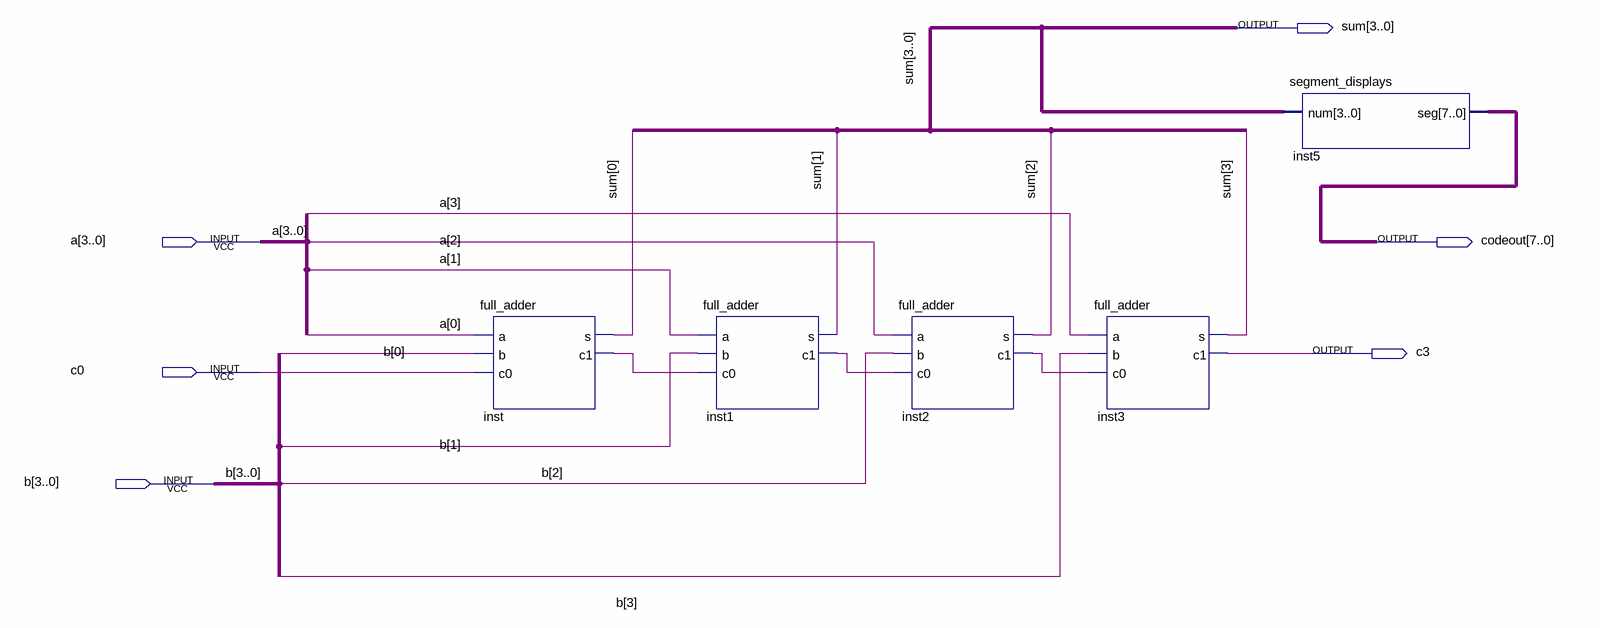
[diagram p0: schematic sheet]
// Quartus schematic full_adder_4.bdf as structural Verilog: 5 symbols, 6 pins
module full_adder_4 (
  input  [3:0] a,
  input  c0,
  input  [3:0] b,
  output [3:0] sum,
  output [7:0] codeout,
  output c3
);

  wire inst1_c1, inst2_c1, inst_c1;

  full_adder inst (.a(a[0]), .b(b[0]), .c0(c0), .s(sum[0]), .c1(inst_c1));
  full_adder inst1 (.a(a[1]), .b(b[1]), .c0(inst_c1), .s(sum[1]), .c1(inst1_c1));
  full_adder inst2 (.a(a[2]), .b(b[2]), .c0(inst1_c1), .s(sum[2]), .c1(inst2_c1));
  full_adder inst3 (.a(a[3]), .b(b[3]), .c0(inst2_c1), .s(sum[3]), .c1(c3));
  segment_displays inst5 (.num(sum), .seg(codeout));
endmodule
